# Altium schematic sheet USB2-HUB.SchDoc
size 1188 x 840 mm
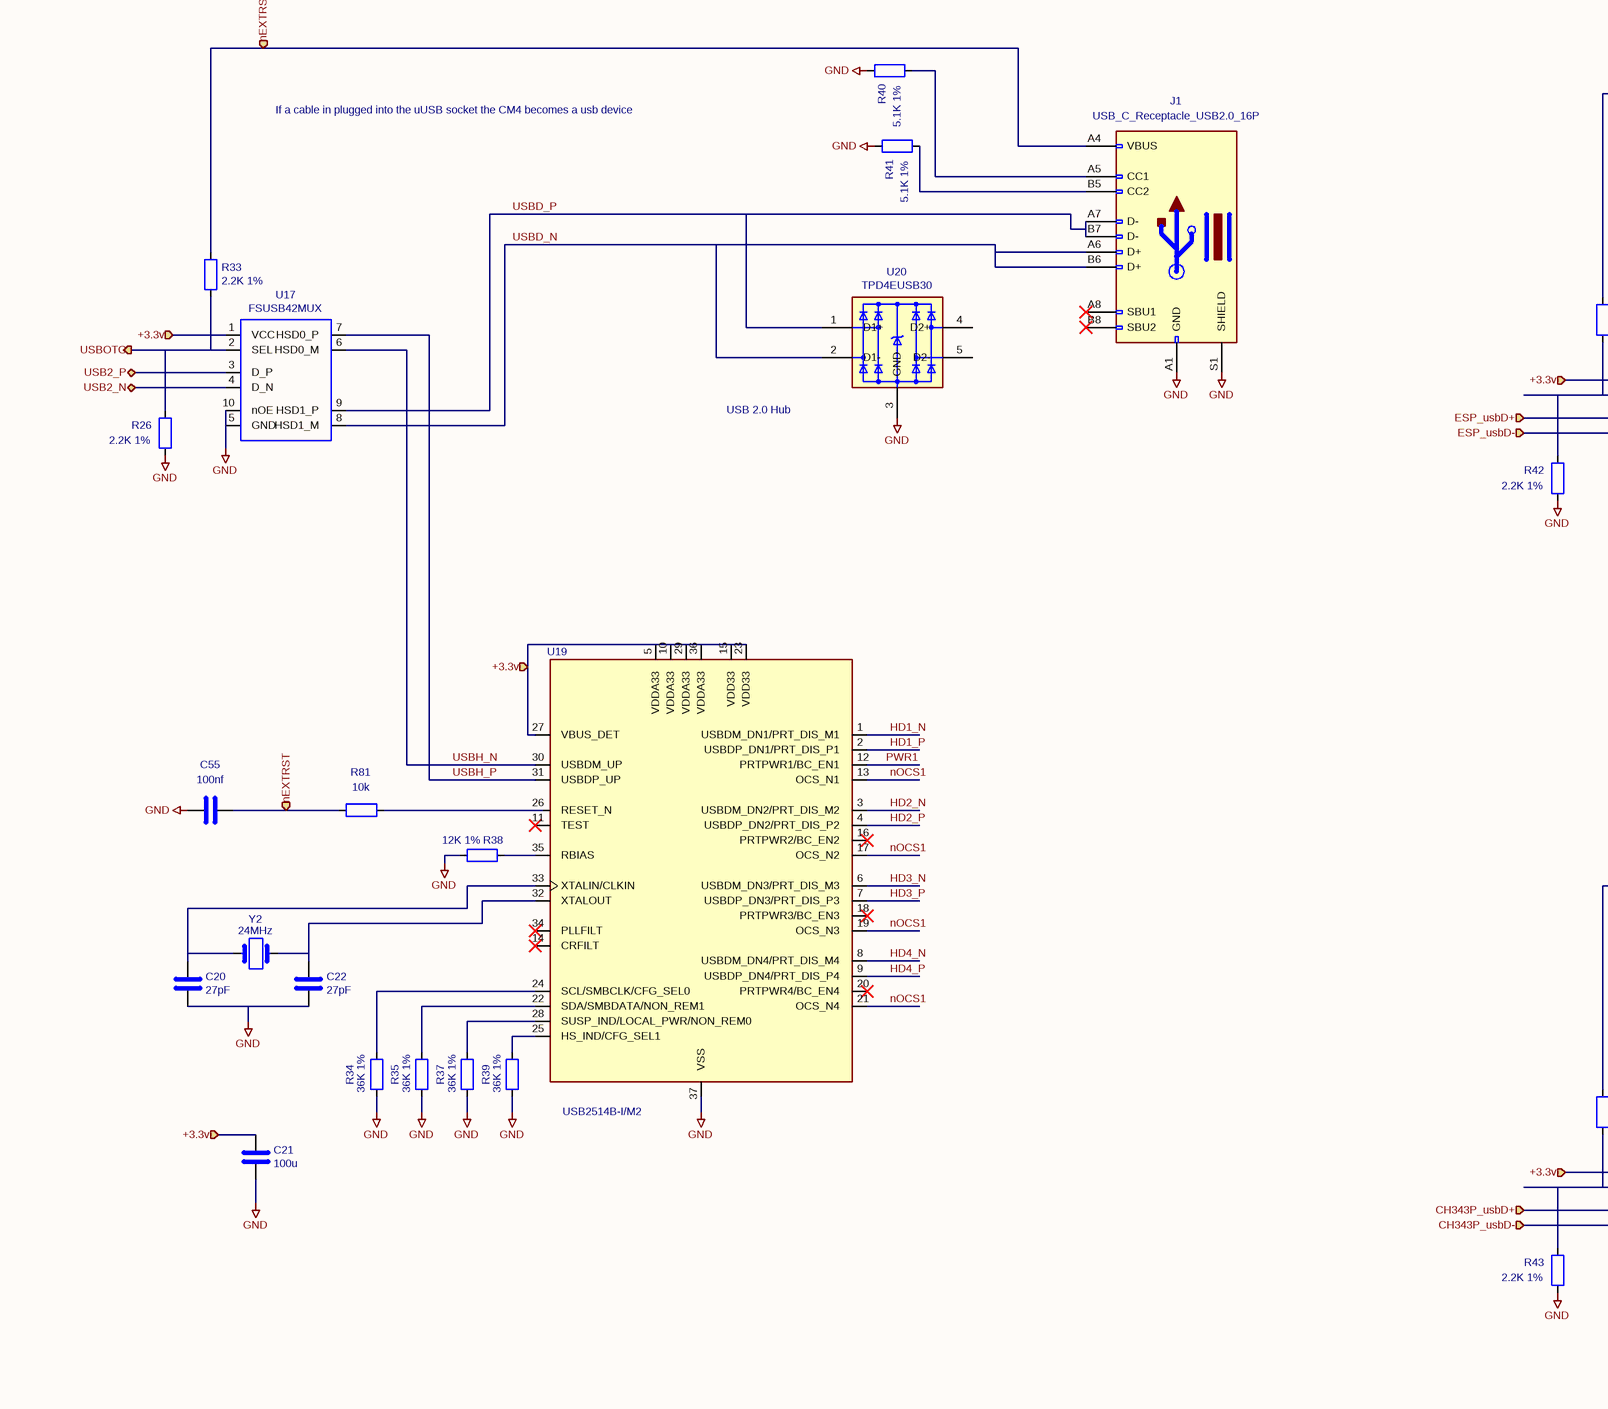
[diagram p0: USB2-HUB.SchDoc, top left]
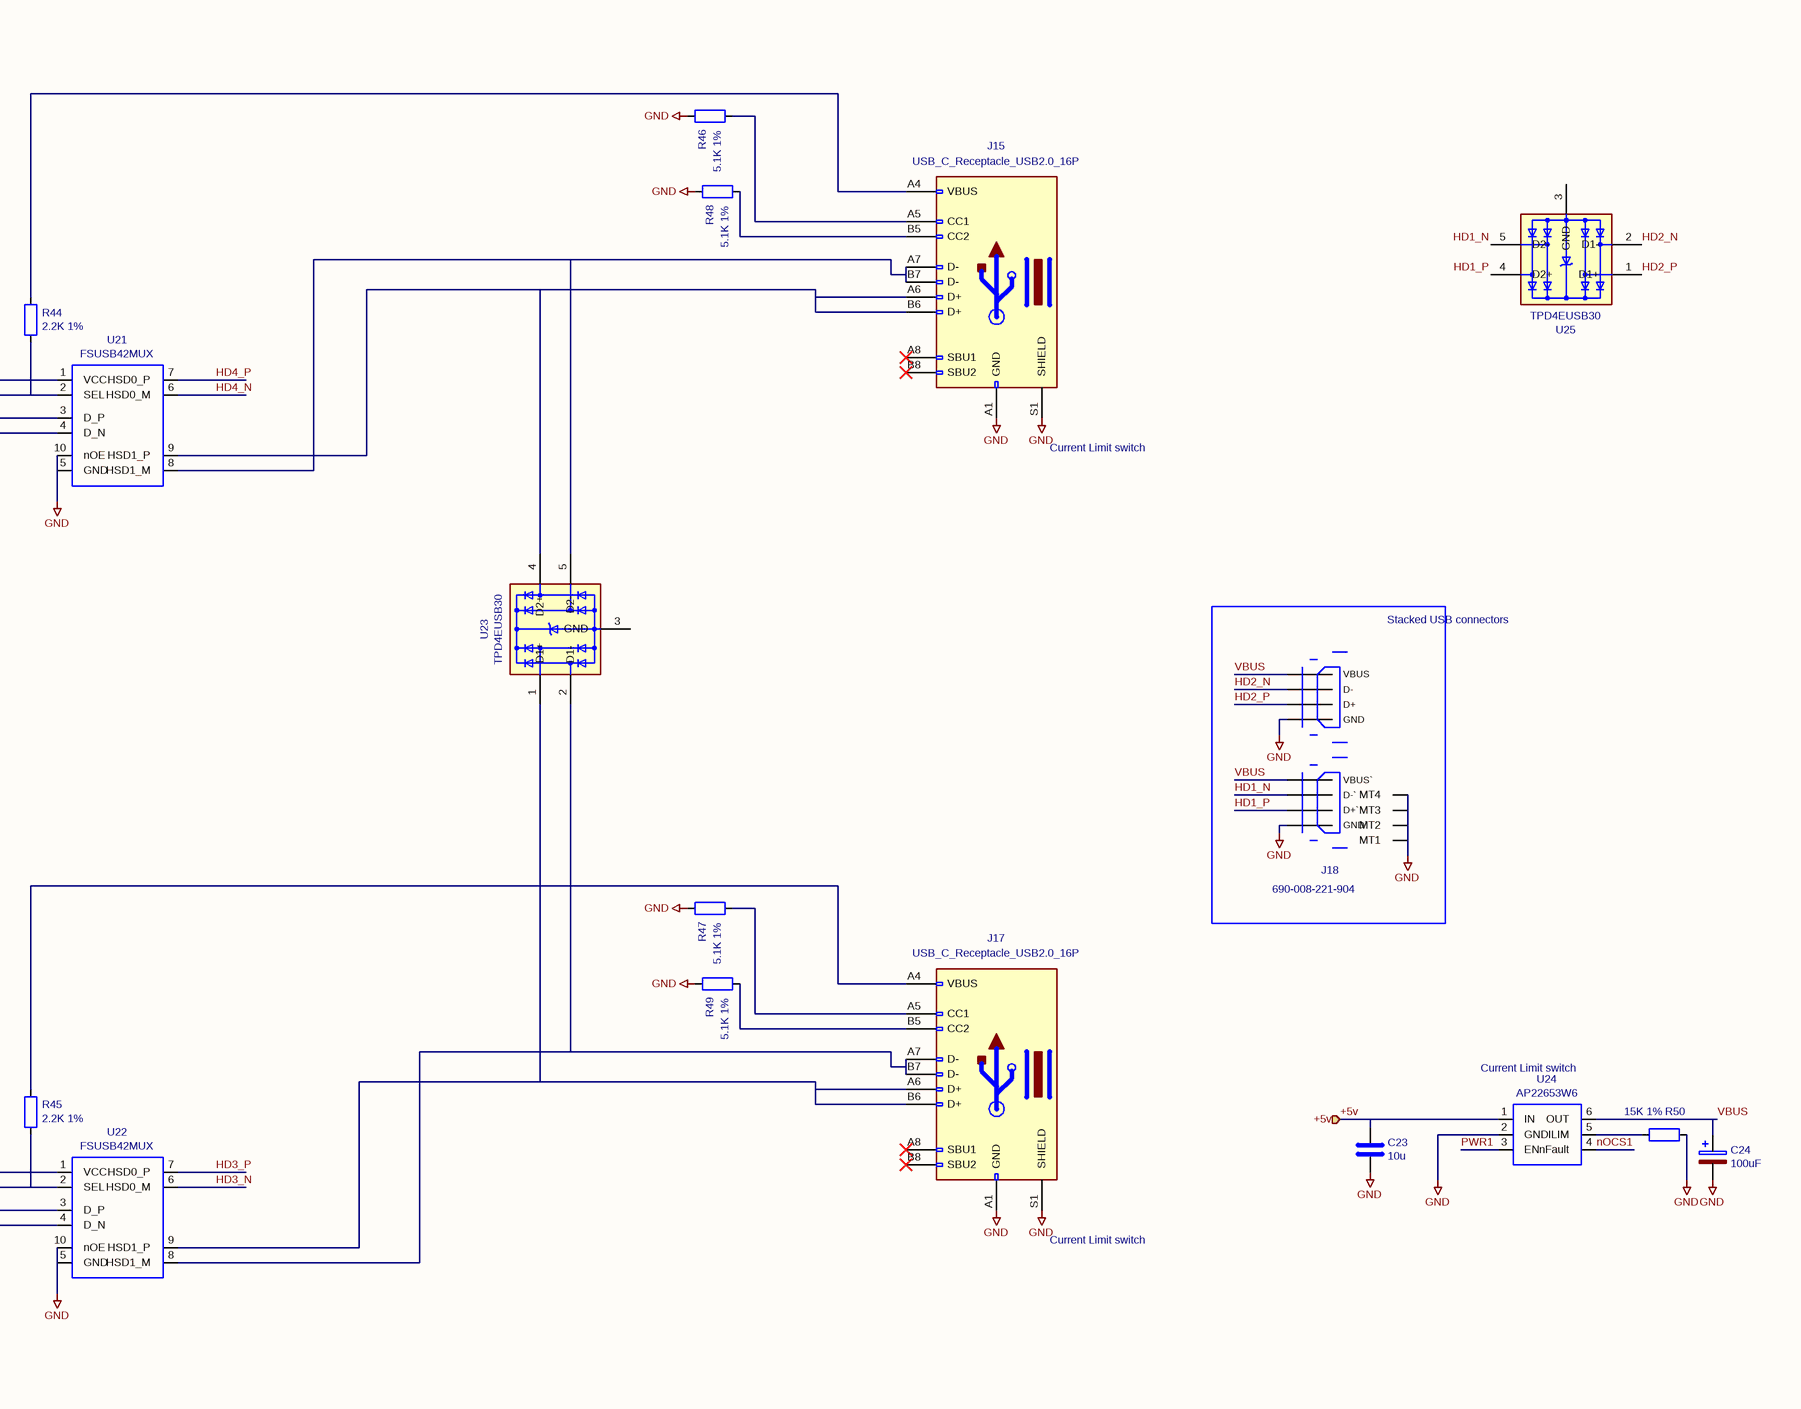
[diagram p1: USB2-HUB.SchDoc, top right]
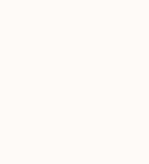
[diagram p2: USB2-HUB.SchDoc, bottom left]

## Parts
C20  27pF  [C_0805_2012Metric]
C21  100u  [C_0805_2012Metric]
C22  27pF  [C_0805_2012Metric]
C23  10u  [C_0805_2012Metric]
C24  100uF  [CP_EIA-7343-31_Kemet-D]
C55  100nf
J1  USB_C_Receptacle_USB2.0_16P  [USB_C_Receptacle_Palconn_UTC16-G]
J15  USB_C_Receptacle_USB2.0_16P  [USB_C_Receptacle_Palconn_UTC16-G]
J17  USB_C_Receptacle_USB2.0_16P  [USB_C_Receptacle_Palconn_UTC16-G]
J18  690-008-221-904  [MOLEX_USB_67298-4090]
R26  2.2K 1%  [R_0805_2012Metric_Pad1.20x1.40mm_HandSolder]
R33  2.2K 1%  [R_0805_2012Metric_Pad1.20x1.40mm_HandSolder]
R34  36K 1%  [R_0805_2012Metric_Pad1.20x1.40mm_HandSolder]
R35  36K 1%  [R_0805_2012Metric_Pad1.20x1.40mm_HandSolder]
R37  36K 1%  [R_0805_2012Metric_Pad1.20x1.40mm_HandSolder]
R38  12K 1%  [R_0805_2012Metric_Pad1.20x1.40mm_HandSolder]
R39  36K 1%  [R_0805_2012Metric_Pad1.20x1.40mm_HandSolder]
R40  5.1K 1%  [R_0805_2012Metric_Pad1.20x1.40mm_HandSolder]
R41  5.1K 1%  [R_0805_2012Metric_Pad1.20x1.40mm_HandSolder]
R42  2.2K 1%  [R_0805_2012Metric_Pad1.20x1.40mm_HandSolder]
R43  2.2K 1%  [R_0805_2012Metric_Pad1.20x1.40mm_HandSolder]
R44  2.2K 1%  [R_0805_2012Metric_Pad1.20x1.40mm_HandSolder]
R45  2.2K 1%  [R_0805_2012Metric_Pad1.20x1.40mm_HandSolder]
R46  5.1K 1%  [R_0805_2012Metric_Pad1.20x1.40mm_HandSolder]
R47  5.1K 1%  [R_0805_2012Metric_Pad1.20x1.40mm_HandSolder]
R48  5.1K 1%  [R_0805_2012Metric_Pad1.20x1.40mm_HandSolder]
R49  5.1K 1%  [R_0805_2012Metric_Pad1.20x1.40mm_HandSolder]
R50  15K 1%  [R_0805_2012Metric_Pad1.20x1.40mm_HandSolder]
R81  10k
U17  FSUSB42MUX  [MSOP-10_3x3mm_P0.5mm]
U19  USB2514B-I/M2  [QFN-36-1EP_6x6mm_P0.5mm_EP3.7x3.7mm]
U20  TPD4EUSB30  [USON-10_2.5x1.0mm_P0.5mm]
U21  FSUSB42MUX  [MSOP-10_3x3mm_P0.5mm]
U22  FSUSB42MUX  [MSOP-10_3x3mm_P0.5mm]
U23  TPD4EUSB30  [USON-10_2.5x1.0mm_P0.5mm]
U24  AP22653W6  [SOT-23-6]
U25  TPD4EUSB30  [USON-10_2.5x1.0mm_P0.5mm]
Y2  24MHz  [Crystal_SMD_HC49-SD]

## Blocks framed on the sheet
Stacked USB connectors: J18

## Ports
+3.3v (in), +5v (in), CH343P_usbD+ (in), CH343P_usbD- (in), ESP_usbD+ (in), ESP_usbD- (in), nEXTRST (in), USB2_N (bidir), USB2_P (bidir), USBOTG (out)

## Nets
GND: C20.2 C21.2 C22.2 C23.2 C24.2 C55.1 J1.A1(GND) J1.S1(SHIELD) J15.A1(GND) J15.S1(SHIELD) J17.A1(GND) J17.S1(SHIELD) J18.4(GND`) J18.8(GND) J18.MT1 J18.MT2 J18.MT3 J18.MT4 R26.2 R34.2 R35.2 R37.2 R38.1 R39.2 R40.1 R41.1 R42.2 R43.2 R46.1 R47.1 R48.1 R49.1 R50.2 U17.5(GND) U17.10(nOE) U19.37(VSS) U20.3(GND) U21.5(GND) U21.10(nOE) U22.5(GND) U22.10(nOE) U24.2(GND)
+3.3v: C21.1 U17.1(VCC) U19.5(VDDA33) U19.10(VDDA33) U19.15(VDD33) U19.23(VDD33) U19.27(VBUS_DET) U19.29(VDDA33) U19.36(VDDA33) U21.1(VCC) U22.1(VCC) ; port +3.3v
+5v: C23.1 U24.1(IN) ; port +5v
CH343P_usbD+: U22.3(D_P) ; port CH343P_usbD+
CH343P_usbD-: U22.4(D_N) ; port CH343P_usbD-
ESP_usbD+: U21.3(D_P) ; port ESP_usbD+
ESP_usbD-: U21.4(D_N) ; port ESP_usbD-
HD1_N: J18.2(D-`) U19.1(USBDM_DN1/PRT_DIS_M1) U25.5(D2-)
HD1_P: J18.3(D+`) U19.2(USBDP_DN1/PRT_DIS_P1) U25.4(D2+)
HD2_N: J18.6(D-) U19.3(USBDM_DN2/PRT_DIS_M2) U25.2(D1-)
HD2_P: J18.7(D+) U19.4(USBDP_DN2/PRT_DIS_P2) U25.1(D1+)
HD3_N: U19.6(USBDM_DN3/PRT_DIS_M3) U22.6(HSD0_M)
HD3_P: U19.7(USBDP_DN3/PRT_DIS_P3) U22.7(HSD0_P)
HD4_N: U19.8(USBDM_DN4/PRT_DIS_M4) U21.6(HSD0_M)
HD4_P: U19.9(USBDP_DN4/PRT_DIS_P4) U21.7(HSD0_P)
nEXTRST: C55.2 J1.A4(VBUS) R33.1 R81.1 ; port nEXTRST
nOCS1: U19.13(OCS_N1) U19.17(OCS_N2) U19.19(OCS_N3) U19.21(OCS_N4) U24.4(nFault)
PWR1: U19.12(PRTPWR1/BC_EN1) U24.3(EN)
USB2_N: U17.4(D_N) ; port USB2_N
USB2_P: U17.3(D_P) ; port USB2_P
USBD_N: J1.A6(D+) J1.B6(D+) U17.8(HSD1_M) U20.2(D1-)
USBD_P: J1.A7(D-) J1.B7(D-) U17.9(HSD1_P) U20.1(D1+)
USBH_N: U17.6(HSD0_M) U19.30(USBDM_UP)
USBH_P: U17.7(HSD0_P) U19.31(USBDP_UP)
USBOTG: R26.1 R33.2 U17.2(SEL) ; port USBOTG
VBUS: C24.1 J18.1(VBUS`) J18.5(VBUS) U24.6(OUT)
NetC20_1: C20.1 U19.33(XTALIN/CLKIN) Y2.1
NetC22_1: C22.1 U19.32(XTALOUT) Y2.2
NetJ1_A5: J1.A5(CC1) R40.2
NetJ1_B5: J1.B5(CC2) R41.2
NetJ15_A4: J15.A4(VBUS) R44.1
NetJ15_A5: J15.A5(CC1) R46.2
NetJ15_A6: J15.A6(D+) J15.B6(D+) U21.9(HSD1_P) U23.4(D2+)
NetJ15_A7: J15.A7(D-) J15.B7(D-) U21.8(HSD1_M) U23.5(D2-)
NetJ15_B5: J15.B5(CC2) R48.2
NetJ17_A4: J17.A4(VBUS) R45.1
NetJ17_A5: J17.A5(CC1) R47.2
NetJ17_A6: J17.A6(D+) J17.B6(D+) U22.9(HSD1_P) U23.1(D1+)
NetJ17_A7: J17.A7(D-) J17.B7(D-) U22.8(HSD1_M) U23.2(D1-)
NetJ17_B5: J17.B5(CC2) R49.2
NetR34_1: R34.1 U19.24(SCL/SMBCLK/CFG_SEL0)
NetR35_1: R35.1 U19.22(SDA/SMBDATA/NON_REM1)
NetR37_1: R37.1 U19.28(SUSP_IND/LOCAL_PWR/NON_REM0)
NetR38_2: R38.2 U19.35(RBIAS)
NetR39_1: R39.1 U19.25(HS_IND/CFG_SEL1)
NetR42_1: R42.1 R44.2 U21.2(SEL)
NetR43_1: R43.1 R45.2 U22.2(SEL)
NetR50_1: R50.1 U24.5(ILIM)
NetR81_2: R81.2 U19.26(RESET_N)

Not connected (* = marked no-connect by the designer): J1 A8(SBU1)* A9(VBUS) A12(GND) B1(GND) B4(VBUS) B8(SBU2)* B9(VBUS) B12(GND); J15 A8(SBU1)* A9(VBUS) A12(GND) B1(GND) B4(VBUS) B8(SBU2)* B9(VBUS) B12(GND); J17 A8(SBU1)* A9(VBUS) A12(GND) B1(GND) B4(VBUS) B8(SBU2)* B9(VBUS) B12(GND); U19 11(TEST)* 14(CRFILT)* 16(PRTPWR2/BC_EN2)* 18(PRTPWR3/BC_EN3)* 20(PRTPWR4/BC_EN4)* 34(PLLFILT)*; U20 4(D2+) 5(D2-) 6 7 8(GND) 9 10; U23 3(GND) 6 7 8(GND) 9 10; U25 3(GND) 6 7 8(GND) 9 10

## Notes on the sheet
- If a cable in plugged into the uUSB socket the CM4 becomes a usb device
- USB 2.0 Hub
- (near J15) Current Limit switch
- (near U24) Current Limit switch
- (near J17) Current Limit switch
- 1
- 2
- 3
- 4
- 5
- 6
- 7
- 8
- 9
- 10
- 11
- 12
- 13
- 14
- 15
- 16
- 17
- 18
- 19
- 20
- 21
- 22
- 23
- A
- B
- C
- D
- E
- F
- G
- H
- I
- J
- K
- L
- M
- N
- O
- P
- www.raspberrypi.com <http://www.raspberrypi.com>
- Title: Compute Module 4 IO Board - USB
- File: USB2-HUB.kicad_sch
- Sheet: /
- © 2020-2022 Raspberry Pi Ltd (formerly Raspberry Pi (Trading) Ltd.)
- KiCad E.D.A.  kicad (5.1.4)-1
- Size: A0
- Date:
- Rev: 1
- Id: 1/1

## Library data of the parts
C20 C22 = C: Part Description: 27pF 5% 50V Ceramic Capacitor C0G, NP0 0402 (1005 Metric); Description: Unpolarized capacitor; Field8: UCAP00738; Field5: 490-17672-1-ND; Field6: GJM1555C1H270JB01D; Field7: Murata; Field4: Digikey; Value: 27pF; Footprint: Capacitor_SMD:C_0805_2012Metric
C21 C23 = C: Part Description: 10uF 10% 10V Ceramic Capacitor X7R 0805 (2012 Metric); Description: Unpolarized capacitor; Field5: 490-14381-1-ND; Field4: Digikey; Field6: GRM21BR71A106KA73L; Field7: Murata; Field8: 111893011; Footprint: Capacitor_SMD:C_0805_2012Metric
  C21: Value: 100u
  C23: Value: 10u
C24 = CP: Part Description: Capacitor, SP-Cap, 100u, 6.3V, 15mR ESR; Field4: Mouser; Field5: 667-EEF-CX0J101R; Value: 100uF; Footprint: Capacitor_Tantalum_SMD:CP_EIA-7343-31_Kemet-D
C55 = C: Description: Unpolarized capacitor; Value: 100nf
J1 J15 J17 = USB_C_Receptacle_USB2.0_16P: Description: USB 2.0-only 16P Type-C Receptacle connector; Value: USB_C_Receptacle_USB2.0_16P; Footprint: Connector_USB:USB_C_Receptacle_Palconn_UTC16-G
J18 = USB_67298-4090: Part Description: USB-A (USB TYPE-A), Stacked Receptacle Connector 8 Position Through Hole, Right Angle; Field4: Farnell; Field5: 2751688; Field6: None; Field7: Molex; Field8: None; Value: 690-008-221-904; Footprint: CM4IO:MOLEX_USB_67298-4090
R26 R33 R40-R49 = R: Part Description: Resistor 2.2K M1005 1% 63mW; Description: Resistor; Field4: Farnell; Field5: 9239278; Field7: KOA EUROPE GMBH; Field6: RK73G1ETQTP2201D; Field8: 120889581; Footprint: Resistor_SMD:R_0805_2012Metric_Pad1.20x1.40mm_HandSolder
  R26 R33 R42-R45: Value: 2.2K 1%
  R40 R41 R46-R49: Value: 5.1K 1%
R34 R35 R37 R39 = R: Part Description: Resistor 36K M1005 1% 63mW; Description: Resistor; Field4: Farnell; Field5: 1458788; Field7: Rohm; Field6: MCR01MZPF3602; Value: 36K 1%; Footprint: Resistor_SMD:R_0805_2012Metric_Pad1.20x1.40mm_HandSolder
R38 = R: Part Description: Resistor 12K M1005 1% 63mW; Description: Resistor; Field4: Farnell; Field5: 9239367; Field7: Rohm; Field6: MCR01MZPF1202; Value: 12K 1%; Footprint: Resistor_SMD:R_0805_2012Metric_Pad1.20x1.40mm_HandSolder
R50 = R: Part Description: Resistor 15K M1005 1% 63mW; Description: Resistor; Field4: Farnell; Field5: 9239375; Field6: MCR01MZPF1502; Field7: Rohm; Field8: 120891581; Value: 15K 1%; Footprint: Resistor_SMD:R_0805_2012Metric_Pad1.20x1.40mm_HandSolder
R81 = R: Description: Resistor; Value: 10k
U17 U21 U22 = FSUSB42MX: Part Description: USB Switch IC 1 Channel 10-MSOP; Field4: Farnell; Field5: 2564479; Field7: Onsemi; Field6: FSUSB42MUX; Value: FSUSB42MUX; Footprint: Package_SO:MSOP-10_3x3mm_P0.5mm
U19 = USB2514B_Bi: Part Description: USB Hub Controller USB Interface 36-SQFN (6x6); Description: USB 2.0 Hi-Speed Hub Controller; Field4: Farnell; Field5: 2775060; Field7: Microchip; Field8: UICC00931; Field6: USB2514B-I/M2; Value: USB2514B-I/M2; Footprint: Package_DFN_QFN:QFN-36-1EP_6x6mm_P0.5mm_EP3.7x3.7mm
U20 U23 U25 = TPD4EUSB30: Part Description: Quad TVS diode for high speed signals (USB3, GigE etc.); Field4: Farnell; Field5: 2335455; Field6: CDDFN10-3324P-13; Field7: Bourns; Field8: UDIO00346; Value: TPD4EUSB30; Footprint: Package_SON:USON-10_2.5x1.0mm_P0.5mm
U24 = AP2553W6: Part Description: Power Switch/Driver 1:1 P-Channel 2.1A SOT-23-6; Field4: Digikey; Field5: AP2553W6-7DICT-ND; Field7: Diodes; Field6: AP22653W6; Value: AP22653W6; Footprint: Package_TO_SOT_SMD:SOT-23-6
Y2 = Crystal: Part Description: 24MHz Crystal 18pf 30ppm 30ppm; Description: Two pin crystal; Field4: Farnell; Field5: 2508493; Field7: AEL; Field6: X24M000000S128; Value: 24MHz; Footprint: Crystal:Crystal_SMD_HC49-SD